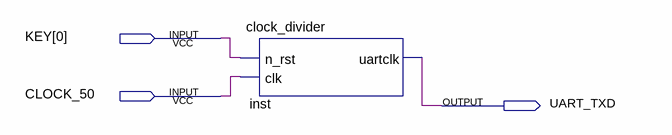
[diagram p0: schematic sheet]
// Quartus schematic clock_divider_tester.bdf as structural Verilog: 1 symbols, 3 pins
module clock_divider_tester (
  input  [0:0] KEY,
  input  CLOCK_50,
  output UART_TXD
);

  clock_divider inst (.n_rst(KEY[0]), .clk(CLOCK_50), .uartclk(UART_TXD));
endmodule
